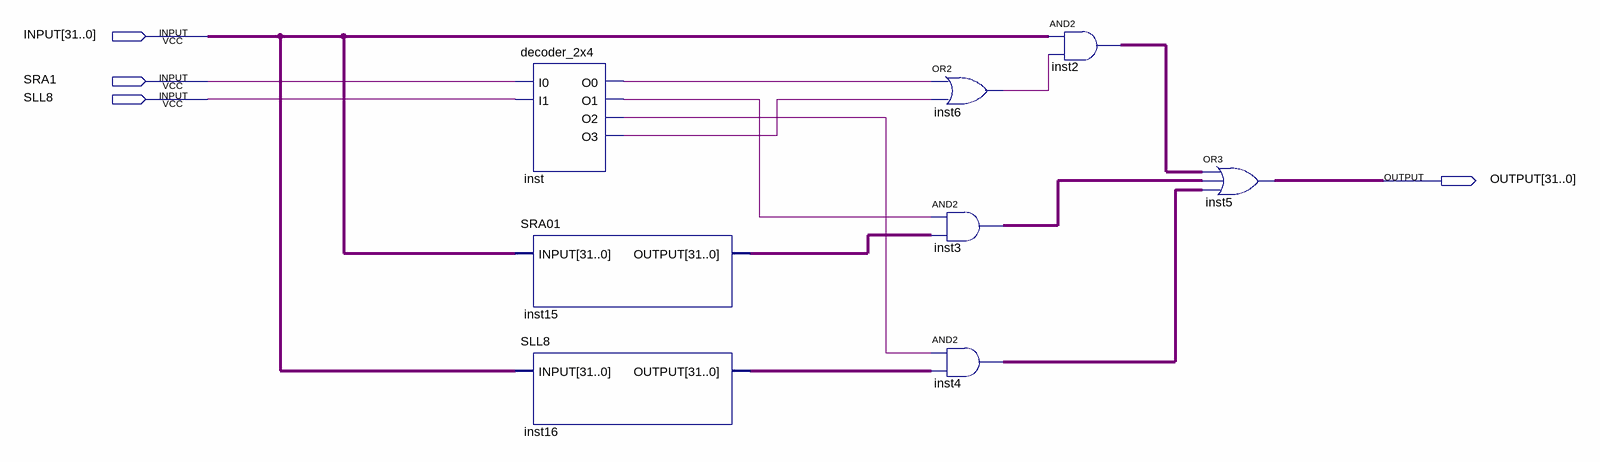
[diagram p0: schematic sheet]
// Quartus schematic SHIFTER.bdf as structural Verilog: 8 symbols, 4 pins
module SHIFTER (
  input  [31:0] INPUT,
  input  SRA1,
  input  SLL8,
  output [31:0] OUTPUT
);

  wire inst6_out, inst_o0, inst_o1, inst_o2, inst_o3;
  wire [31:0] inst2_out, inst3_out, inst4_out, inst15_output, inst16_output;

  decoder_2x4 inst (.I0(SRA1), .I1(SLL8), .O0(inst_o0), .O1(inst_o1), .O2(inst_o2), .O3(inst_o3));
  SRA01 inst15 (.INPUT(INPUT), .OUTPUT(inst15_output));
  SLL8 inst16 (.INPUT(INPUT), .OUTPUT(inst16_output));
  or inst6 (inst6_out, inst_o0, inst_o3);
  assign inst3_out = {32{inst_o1}} & inst15_output;  // AND2 inst3, 32 bits wide
  assign inst4_out = {32{inst_o2}} & inst16_output;  // AND2 inst4, 32 bits wide
  assign inst2_out = INPUT & {32{inst6_out}};  // AND2 inst2, 32 bits wide
  assign OUTPUT = inst2_out | inst3_out | inst4_out;  // OR3 inst5, 32 bits wide
endmodule
